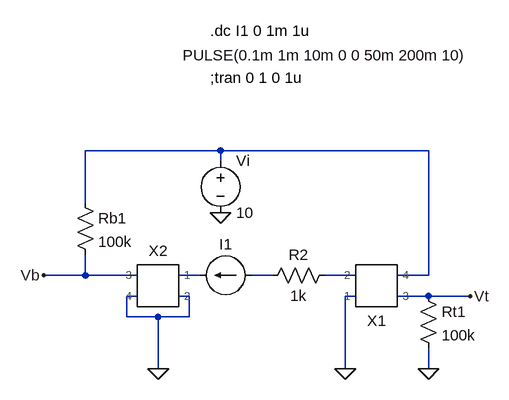
[diagram p0: schematic voltage_divider.asc]
voltage_divider.asc, the LTspice schematic file:
Version 4
SHEET 1 880 680
WIRE 80 -48 -128 -48
WIRE 400 -48 80 -48
WIRE 80 -32 80 -48
WIRE -128 32 -128 -48
WIRE -128 144 -128 112
WIRE -128 144 -192 144
WIRE -48 144 -128 144
WIRE 48 144 16 144
WIRE 160 144 128 144
WIRE 288 144 240 144
WIRE 400 144 400 -48
WIRE 400 144 352 144
WIRE -48 176 -64 176
WIRE 32 176 16 176
WIRE 288 176 272 176
WIRE 400 176 352 176
WIRE 464 176 400 176
WIRE -64 208 -64 176
WIRE -16 208 -64 208
WIRE 32 208 32 176
WIRE 32 208 -16 208
WIRE -16 288 -16 208
WIRE 272 288 272 176
WIRE 400 288 400 256
FLAG 80 48 0
FLAG -16 288 0
FLAG 272 288 0
FLAG 400 288 0
FLAG -192 144 Vb
FLAG 464 176 Vt
SYMBOL ZX1 304 128 M180
SYMATTR InstName X1
SYMBOL ZX1 0 192 M0
SYMATTR InstName X2
SYMBOL res -144 16 R0
SYMATTR InstName Rb1
SYMATTR Value 100k
SYMBOL voltage 80 -48 R0
WINDOW 123 0 0 Left 0
WINDOW 39 0 0 Left 0
SYMATTR InstName Vi
SYMATTR Value 10
SYMBOL res 256 128 R90
WINDOW 0 0 56 VBottom 2
WINDOW 3 32 56 VTop 2
SYMATTR InstName R2
SYMATTR Value 1k
SYMBOL current 128 144 R90
WINDOW 0 -32 40 VBottom 2
WINDOW 3 -354 -113 VTop 2
WINDOW 123 0 0 Left 0
WINDOW 39 0 0 Left 0
SYMATTR InstName I1
SYMATTR Value PULSE(0.1m 1m 10m 0 0 50m 200m 10)
SYMBOL res 384 160 R0
SYMATTR InstName Rt1
SYMATTR Value 100k
TEXT 64 -232 Left 2 !.dc I1 0 1m 1u
TEXT 64 -160 Left 2 !;tran 0 1 0 1u

The netlist it stands for:
* voltage_divider.asc
XX1 0 N004 Vt N001 ZX1  ; pins 1 2 3 4
XX2 N002 0 Vb 0 ZX1  ; pins 1 2 3 4
Rb1 N001 Vb 100k
Vi N001 0 10
R2 N004 N003 1k
I1 N003 N002 PULSE(0.1m 1m 10m 0 0 50m 200m 10)
Rt1 Vt 0 100k
.dc I1 0 1m 1u
;tran 0 1 0 1u
.backanno
.end